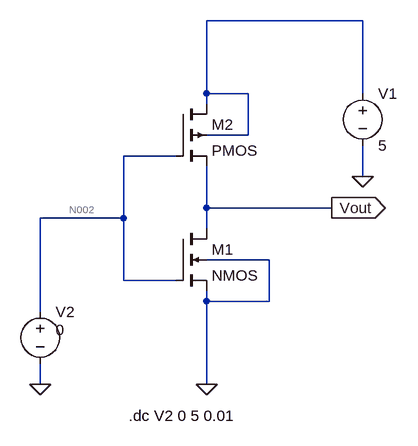
[diagram p0: schematic Inverter.asc]
Inverter.asc, the LTspice schematic file:
Version 4
SHEET 1 880 680
WIRE 464 -112 224 -112
WIRE 224 0 224 -112
WIRE 288 0 224 0
WIRE 464 0 464 -112
WIRE 224 16 224 0
WIRE 288 64 288 0
WIRE 288 64 224 64
WIRE 176 96 96 96
WIRE 464 128 464 80
WIRE 224 176 224 112
WIRE 416 176 224 176
WIRE 96 192 96 96
WIRE 96 192 -32 192
WIRE 224 208 224 176
WIRE 320 256 224 256
WIRE 96 288 96 192
WIRE 176 288 96 288
WIRE 224 320 224 304
WIRE 320 320 320 256
WIRE 320 320 224 320
WIRE -32 336 -32 192
WIRE -32 448 -32 416
WIRE 224 448 224 320
FLAG -32 448 0
FLAG 464 128 0
FLAG 224 448 0
FLAG 416 176 Vout
IOPIN 416 176 Out
SYMBOL nmos4 176 208 R0
SYMATTR InstName M1
SYMATTR Value2 l=0.5u w=4u
SYMBOL pmos4 176 16 R0
SYMATTR InstName M2
SYMATTR Value2 l=0.5u w=4u
SYMBOL voltage 464 -16 R0
WINDOW 123 0 0 Left 0
WINDOW 39 0 0 Left 0
SYMATTR InstName V1
SYMATTR Value 5
SYMBOL voltage -32 320 R0
WINDOW 3 24 44 Left 2
WINDOW 123 0 0 Left 0
WINDOW 39 0 0 Left 0
SYMATTR InstName V2
SYMATTR Value 0
TEXT 104 496 Left 2 !.dc V2 0 5 0.01

The netlist it stands for:
* Inverter.asc
M1 Vout N002 0 0 NMOS l=0.5u w=4u
M2 N001 N002 Vout N001 PMOS l=0.5u w=4u
V1 N001 0 5
V2 N002 0 0
.model NMOS NMOS
.model PMOS PMOS
.lib standard.mos
.dc V2 0 5 0.01
.backanno
.end

* Results of the author's LTspice run, read from the files saved beside the schematic
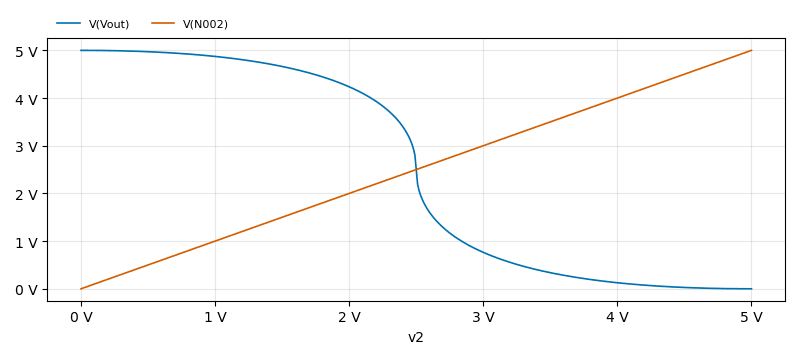
[diagram p1: DC transfer characteristic of Inverter.asc, plotted from the saved traces]
* DC transfer characteristic, 1 run:
*   V(Vout): 5 V at v2=0 V, 12.47 nV at v2=5 V, min 12.47 nV, max 5 V
*   V(N002): 0 V at v2=0 V, 5 V at v2=5 V, min 0 V, max 5 V